# EAGLE design TeensyParser (EAGLE 9.4.2)
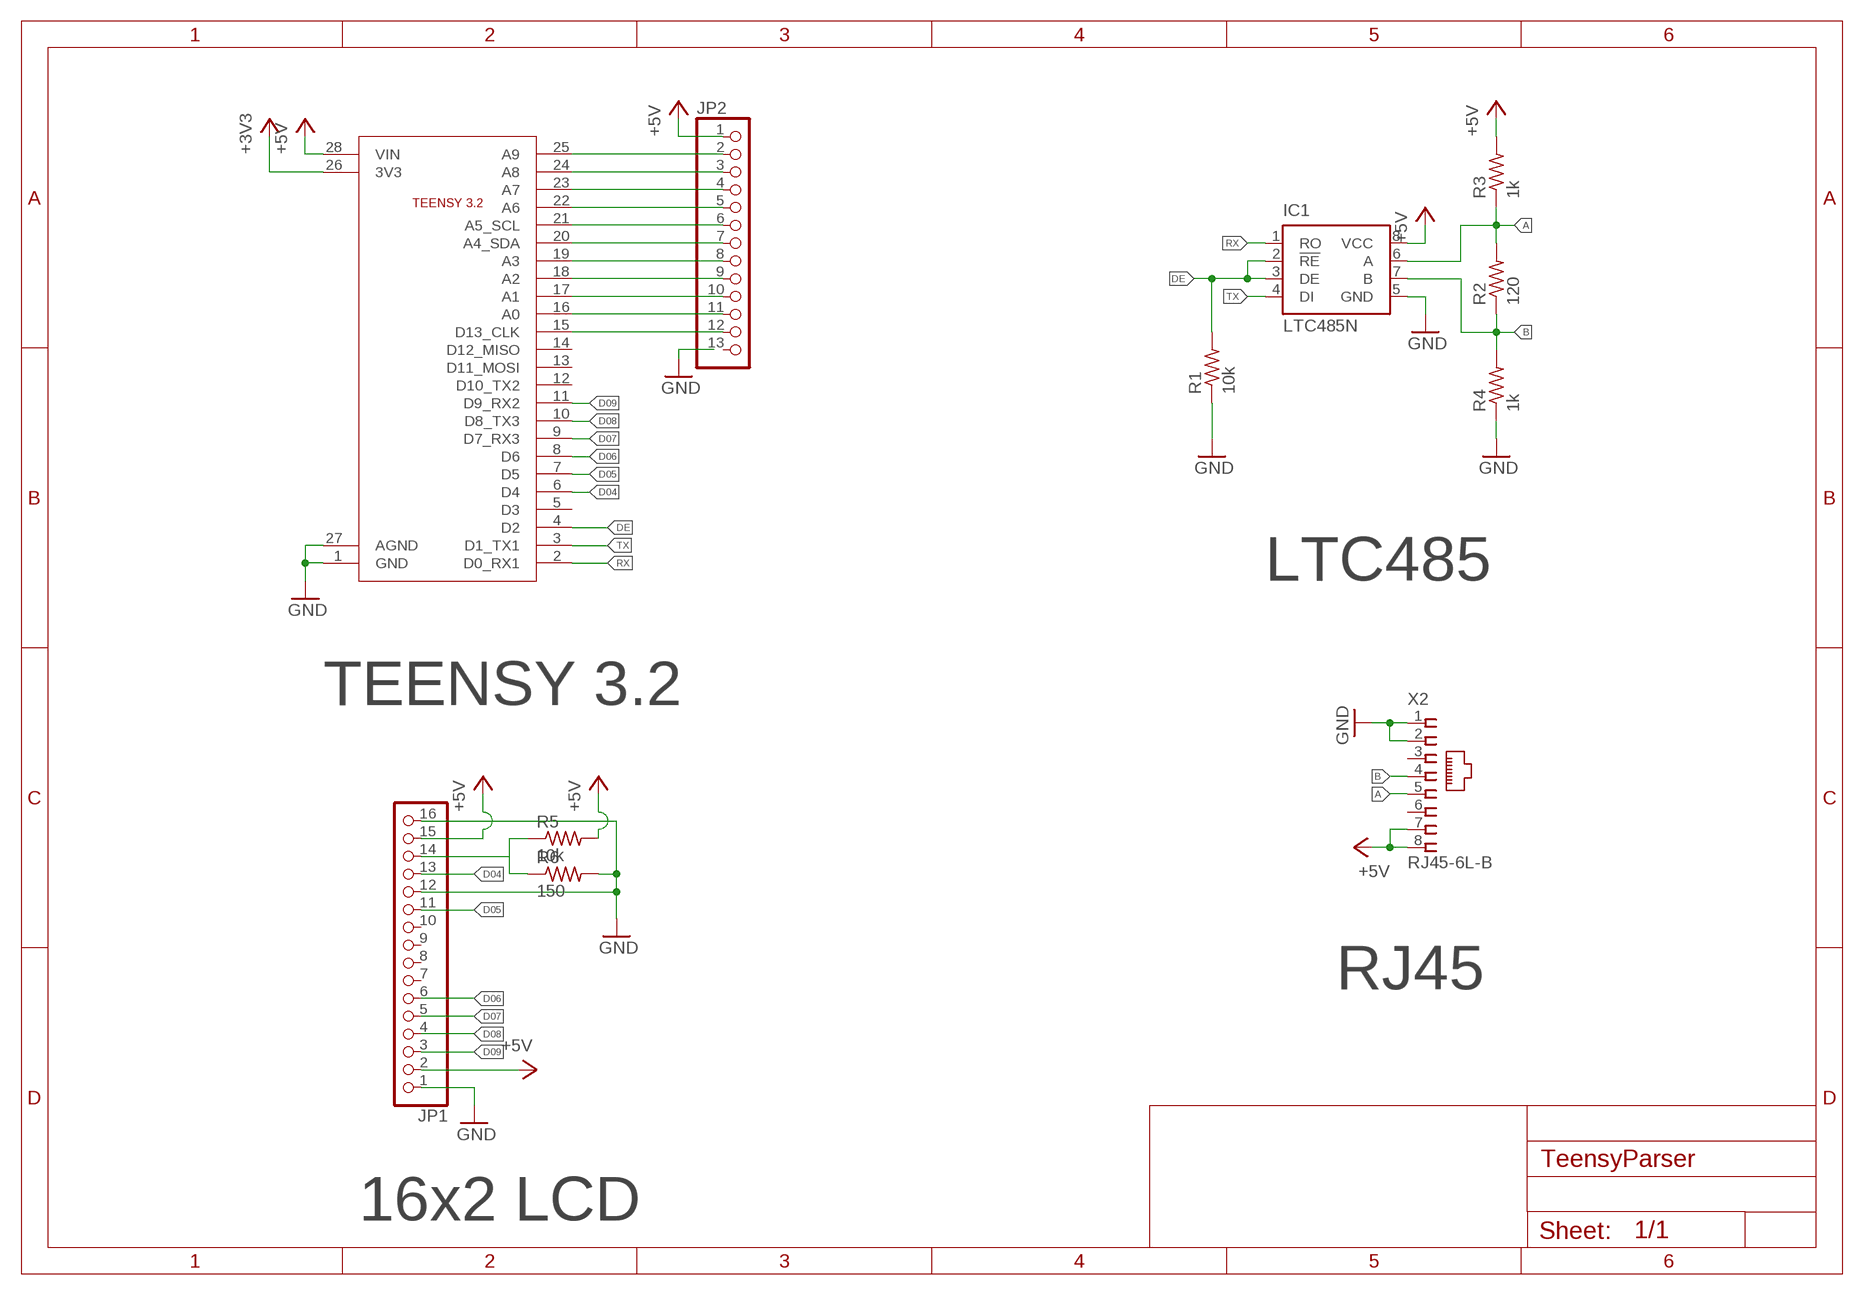
[diagram p0: schematic, sheet 1]

## Parts
IC1  LTC485N  [DIL08]
JP1  PINHD-1X16  [1X16]
JP2  PINHD-1X13  [1X13]
R1  10k  R-US_0204/7  [0204/7]
R2  120  R-US_0204/7  [0204/7]
R3  1k  R-US_0204/7  [0204/7]
R4  1k  R-US_0204/7  [0204/7]
R5  10k  R-US_0204/7  [0204/7]
R6  150  R-US_0204/7  [0204/7]
U$1  TEENSY3.2  [TEENSY]
X2  RJ45-6L-B  [RJ45-NO-SHIELD]

## Nets
+3V3: U$1.26(3V3)
+5V: IC1.8(VCC) JP1.2 JP1.15 JP2.1 R3.2 R5.2 U$1.28(VIN) X2.7 X2.8
A: IC1.6(A) R2.2 R3.1 X2.5
B: IC1.7(B) R2.1 R4.2 X2.4
D04: JP1.13 U$1.6(D4)
D05: JP1.11 U$1.7(D5)
D06: JP1.6 U$1.8(D6)
D07: JP1.5 U$1.9(D7_RX3)
D08: JP1.4 U$1.10(D8_TX3)
D09: JP1.3 U$1.11(D9_RX2)
DE: IC1.2(!RE) IC1.3(DE) R1.2 U$1.4(D2)
GND: IC1.5(GND) JP1.1 JP1.12 JP1.16 R1.1 R4.1 R6.2 U$1.1(GND) U$1.27(AGND) X2.1 X2.2
N$1: JP2.2 U$1.25(A9)
N$2: JP2.3 U$1.24(A8)
N$3: JP2.4 U$1.23(A7)
N$4: JP2.5 U$1.22(A6)
N$5: JP2.6 U$1.21(A5_SCL)
N$6: JP2.7 U$1.20(A4_SDA)
N$7: JP2.8 U$1.19(A3)
N$8: JP2.9 U$1.18(A2)
N$9: JP2.10 U$1.17(A1)
N$10: JP2.11 U$1.16(A0)
N$11: JP2.12 U$1.15(D13_CLK)
N$21: JP1.14 R5.1 R6.1
RX: IC1.1(RO) U$1.2(D0_RX1)
TX: IC1.4(DI) U$1.3(D1_TX1)
Unconnected: JP1.7 JP1.8 JP1.9 JP1.10 JP2.13 U$1.5(D3) U$1.12(D10_TX2) U$1.13(D11_MOSI) U$1.14(D12_MISO) X2.3 X2.6

## Notes on the sheet
- LTC485
- TEENSY 3.2
- RJ45
- 16x2 LCD

## Library data of the parts
IC1 = linear-technology:LTC485: Low Power RS485 Interface Transceiver Source: http://www.linear.com/pc/downloadDocument.do?navId=H0,C1,C1007,C1017,P2064,D1718; OC_FARNELL: unknown; OC_NEWARK: unknown
JP1 = pinhead:PINHD-1X16: PIN HEADER
JP2 = pinhead:PINHD-1X13: PIN HEADER
R1-R6 = rcl:R-US_: RESISTOR, American symbol; SPICEPREFIX: R
U$1 = EzerLonginus:TEENSY
X2 = con-tycoelectronics:RJ45: CORCOM Modular RJ Jacks No Shield Source: www.tycoelectronics.com .. ENG_DS_1654001_1099_RJ_L_0507.pdf; MPN: RJ45-6L-B; OC_FARNELL: unknown; OC_NEWARK: 16R6090

## Board
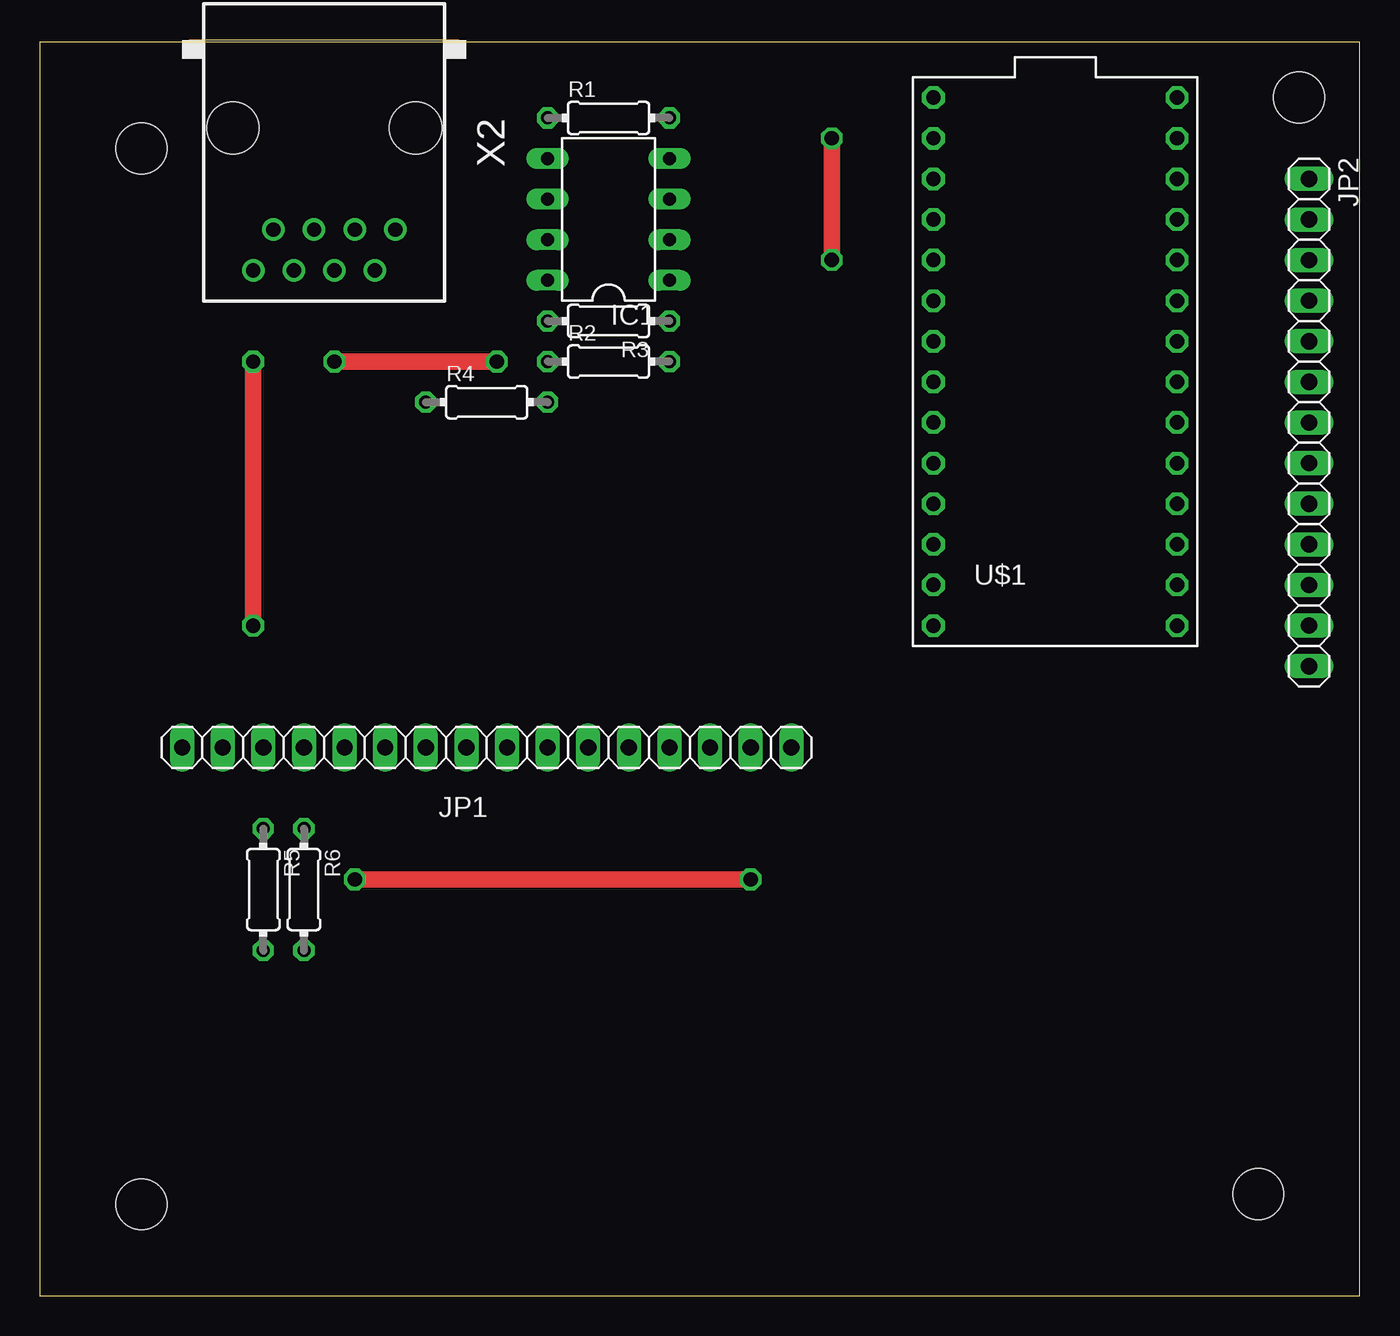
[diagram p1: board, top side]
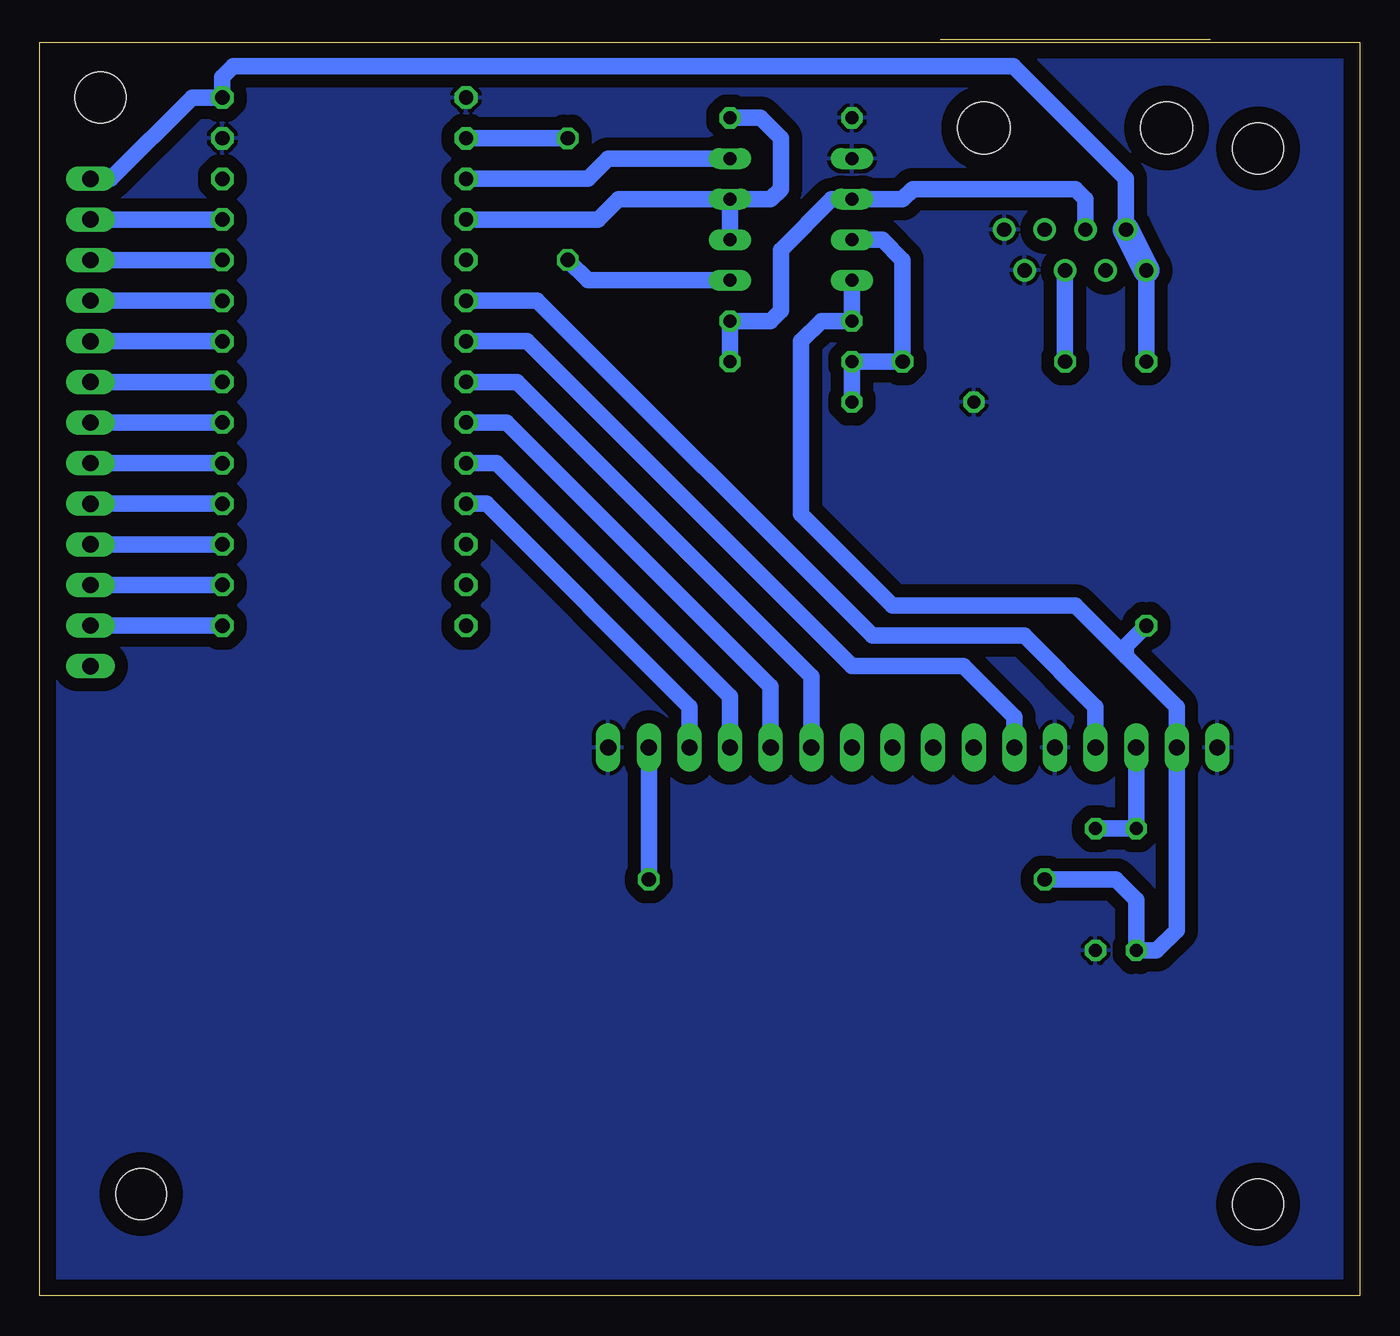
[diagram p2: board, bottom side, seen from below]

Size 82.53 x 78.41 mm. Coordinates in mm from the lower left corner, seen from the top.
Outline: 0,0 82.53,0 82.53,78.41 0,78.41 0,0
Copper layers (1*16): Top 0.035mm / dielectric 1.5mm / Bottom 0.035mm
Design rules "default": minimum track width 6mil, minimum drill 0.35mm, track to track 6mil, track to pad 6mil, pad to pad 6mil, via to via 6mil, smd to smd 6mil, copper to edge 40mil, drill to drill 6mil, minimum pad ring 10mil, minimum via ring 8mil, stop-mask expansion 4mil, vias tented up to drill 0mil, thermal gap 10mil
Holes 3.17 mm at 6.35,71.75 78.74,74.93 76.2,6.35 6.35,5.71

### Footprints (pad centres in the part's own frame; a part is rotated, then mirrored left to right if it is on the bottom)
DIL08 = drill 0.813 long: 1 -3.81,-3.81; 2 -1.27,-3.81; 3 1.27,-3.81; 4 3.81,-3.81; 5 3.81,3.81; 6 1.27,3.81; 7 -1.27,3.81; 8 -3.81,3.81
1X16 = drill 1.016 long: 1 -19.05,0; 2 -16.51,0; 3 -13.97,0; 4 -11.43,0; 5 -8.89,0; 6 -6.35,0; 7 -3.81,0; 8 -1.27,0; 9 1.27,0; 10 3.81,0; 11 6.35,0; 12 8.89,0; 13 11.43,0; 14 13.97,0; 15 16.51,0; 16 19.05,0
1X13 = drill 1.016 long: 1 -15.24,0; 2 -12.7,0; 3 -10.16,0; 4 -7.62,0; 5 -5.08,0; 6 -2.54,0; 7 0,0; 8 2.54,0; 9 5.08,0; 10 7.62,0; 11 10.16,0; 12 12.7,0; 13 15.24,0
0204/7 = drill 0.813 octagon: 1 -3.81,0; 2 3.81,0
TEENSY = drill 0.9 octagon: 1 -7.62,17.78; 2 -7.62,15.24; 3 -7.62,12.7; 4 -7.62,10.16; 5 -7.62,7.62; 6 -7.62,5.08; 7 -7.62,2.54; 8 -7.62,0; 9 -7.62,-2.54; 10 -7.62,-5.08; 11 -7.62,-7.62; 12 -7.62,-10.16; 13 -7.62,-12.7; 14 -7.62,-15.24; 15 7.62,-15.24; 16 7.62,-12.7; 17 7.62,-10.16; 18 7.62,-7.62; 19 7.62,-5.08; 20 7.62,-2.54; 21 7.62,0; 22 7.62,2.54; 23 7.62,5.08; 24 7.62,7.62; 25 7.62,10.16; 26 7.62,12.7; 27 7.62,15.24; 28 7.62,17.78
RJ45-NO-SHIELD = drill 0.9 pad 1.4: 1 -4.445,6.35; 2 -3.175,8.89; 3 -1.905,6.35; 4 -0.635,8.89; 5 0.635,6.35; 6 1.905,8.89; 7 3.175,6.35; 8 4.445,8.89 | hole 3.251: -5.715,0; 5.715,0

### Placement (x,y rotation side)
IC1  35.56,67.31 90 top
JP1  27.94,34.29 180 top
JP2  79.38,54.61 270 top
R1  35.56,73.66 0 top
R2  35.56,58.42 0 top
R3  35.56,60.96 180 top
R4  27.94,55.88 0 top
R5  13.97,25.4 270 top
R6  16.51,25.4 270 top
U$1  63.5,57.15 0 top
X2  17.78,73.03 180 top

### Tracks (layer width: path | path; a pad name or v marks a point on that pad's centre or on a via)
+5V  (via drill 0.9)
  Top 1.016: v13.34,58.42 v13.34,41.91 | v44.45,26.04 v19.68,26.04
  Bottom 1.016: IC1.8 R3.2 33.66,60.96 34.92,59.69 34.92,48.9 29.21,43.18 17.78,43.18 14.61,40.01 | X2.7 14.61,69.85 21.64,76.89 70.43,76.89 71.12,76.2 U$1.28 73.03,74.93 78.11,69.85 JP2.1 | 14.61,40.01 11.43,36.83 JP1.15 11.43,22.86 12.7,21.59 R5.2 13.97,24.77 15.24,26.04 v19.68,26.04 | X2.8 v13.34,58.42 | v13.34,41.91 14.61,40.64 14.61,40.01 | JP1.2 v44.45,26.04
  Bottom 1.651: X2.8 X2.7
A
  Bottom 1.016: X2.5 17.14,68.58 17.78,69.22 27.94,69.22 28.57,68.58 IC1.6 33.02,68.58 36.2,65.41 36.2,61.59 36.83,60.96 R3.1 R2.2
B  (via drill 0.9)
  Top 1.016: v18.41,58.42 v28.57,58.42
  Bottom 1.016: R4.2 R2.1 v28.57,58.42 28.57,64.77 29.84,66.04 IC1.7 | v18.41,58.42 X2.4
D04
  Bottom 1.016: JP1.13 16.51,36.83 20.95,41.27 30.48,41.27 51.44,62.23 U$1.6
D05
  Bottom 1.016: JP1.11 21.59,36.2 24.77,39.37 31.75,39.37 52.07,59.69 U$1.7
D06
  Bottom 1.016: JP1.6 34.29,38.73 52.7,57.15 U$1.8
D07
  Bottom 1.016: JP1.5 36.83,38.1 53.34,54.61 U$1.9
D08
  Bottom 1.016: JP1.4 39.37,37.47 53.98,52.07 U$1.10
D09
  Bottom 1.016: JP1.3 41.91,36.83 54.61,49.53 U$1.11
DE
  Bottom 1.016: R1.2 37.47,73.66 36.2,72.39 36.2,69.22 36.83,68.58 IC1.3 | IC1.3 IC1.2 | IC1.3 46.35,68.58 47.62,67.31 U$1.4
GND
  pour Bottom (isolate 0.813): 0,78.74 82.55,78.74 82.55,0 0,0
N$1
  Bottom 1.016: U$1.25 JP2.2
N$2
  Bottom 1.016: U$1.24 JP2.3
N$3
  Bottom 1.016: U$1.23 JP2.4
N$4
  Bottom 1.016: U$1.22 JP2.5
N$5
  Bottom 1.016: U$1.21 JP2.6
N$6
  Bottom 1.016: U$1.20 JP2.7
N$7
  Bottom 1.016: U$1.19 JP2.8
N$8
  Bottom 1.016: U$1.18 JP2.9
N$9
  Bottom 1.016: U$1.17 JP2.10
N$10
  Bottom 1.016: U$1.16 JP2.11
N$11
  Bottom 1.016: U$1.15 JP2.12
N$21
  Bottom 1.016: JP1.14 R5.1 R6.1
RX  (via drill 0.9)
  Top 1.016: v49.53,72.39 v49.53,64.77
  Bottom 1.016: U$1.2 v49.53,72.39 | v49.53,64.77 48.26,63.5 IC1.1
TX
  Bottom 1.016: IC1.4 46.99,71.12 48.26,69.85 U$1.3